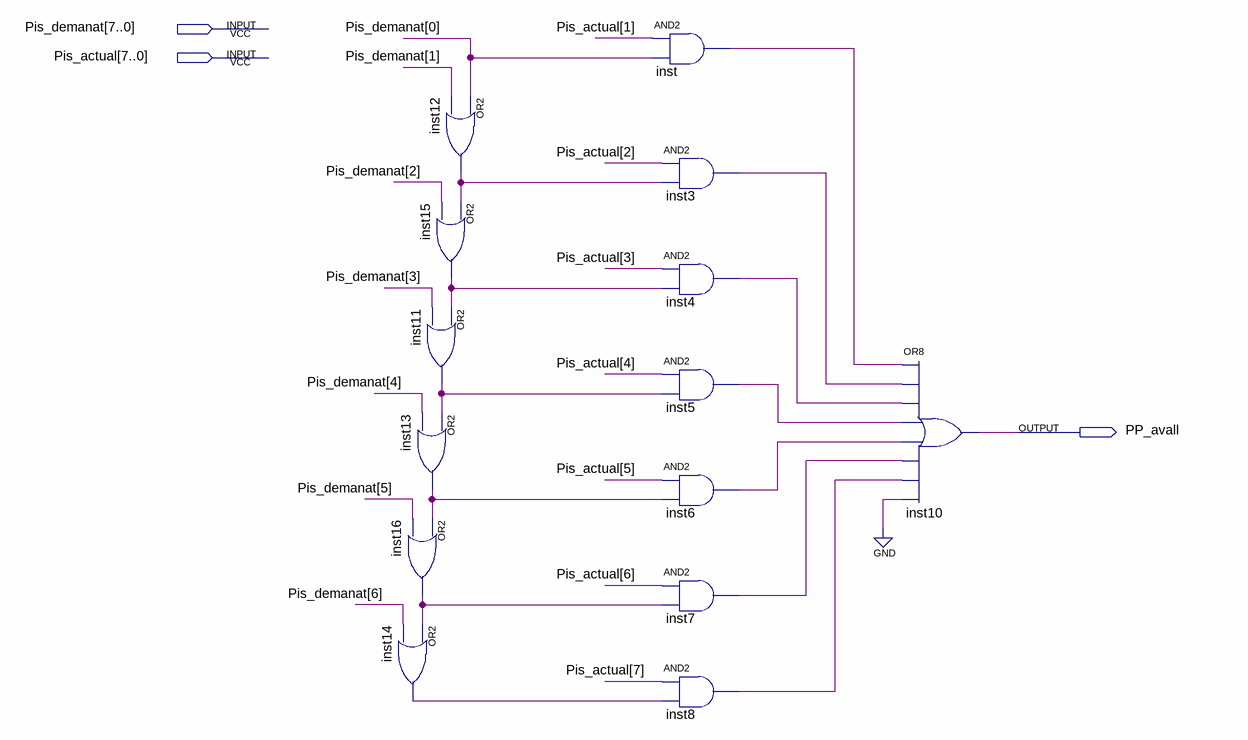
[diagram p0: schematic sheet]
// Quartus schematic Senyals_UC_PP_avall.bdf as structural Verilog: 14 symbols, 3 pins
module Senyals_UC_PP_avall (
  input  [7:0] Pis_demanat,
  input  [7:0] Pis_actual,
  output PP_avall
);

  wire inst3_out, inst4_out, inst5_out, inst6_out, inst7_out, inst8_out, inst11_out, inst12_out, inst13_out,
       inst14_out, inst15_out, inst16_out, inst_out;

  or inst14 (inst14_out, inst16_out, Pis_demanat[6]);
  or inst12 (inst12_out, Pis_demanat[0], Pis_demanat[1]);
  or inst15 (inst15_out, inst12_out, Pis_demanat[2]);
  or inst11 (inst11_out, inst15_out, Pis_demanat[3]);
  or inst13 (inst13_out, inst11_out, Pis_demanat[4]);
  or inst16 (inst16_out, inst13_out, Pis_demanat[5]);
  and inst (inst_out, Pis_actual[1], Pis_demanat[0]);
  and inst3 (inst3_out, Pis_actual[2], inst12_out);
  and inst4 (inst4_out, Pis_actual[3], inst15_out);
  and inst5 (inst5_out, Pis_actual[4], inst11_out);
  and inst6 (inst6_out, Pis_actual[5], inst13_out);
  and inst7 (inst7_out, Pis_actual[6], inst16_out);
  and inst8 (inst8_out, Pis_actual[7], inst14_out);
  or inst10 (PP_avall, inst_out, inst3_out, inst4_out, inst5_out, inst6_out, inst7_out, inst8_out, 1'b0);
endmodule
